# EAGLE design peaks_v30 (EAGLE 5.09)

## Sheet 1 of 3
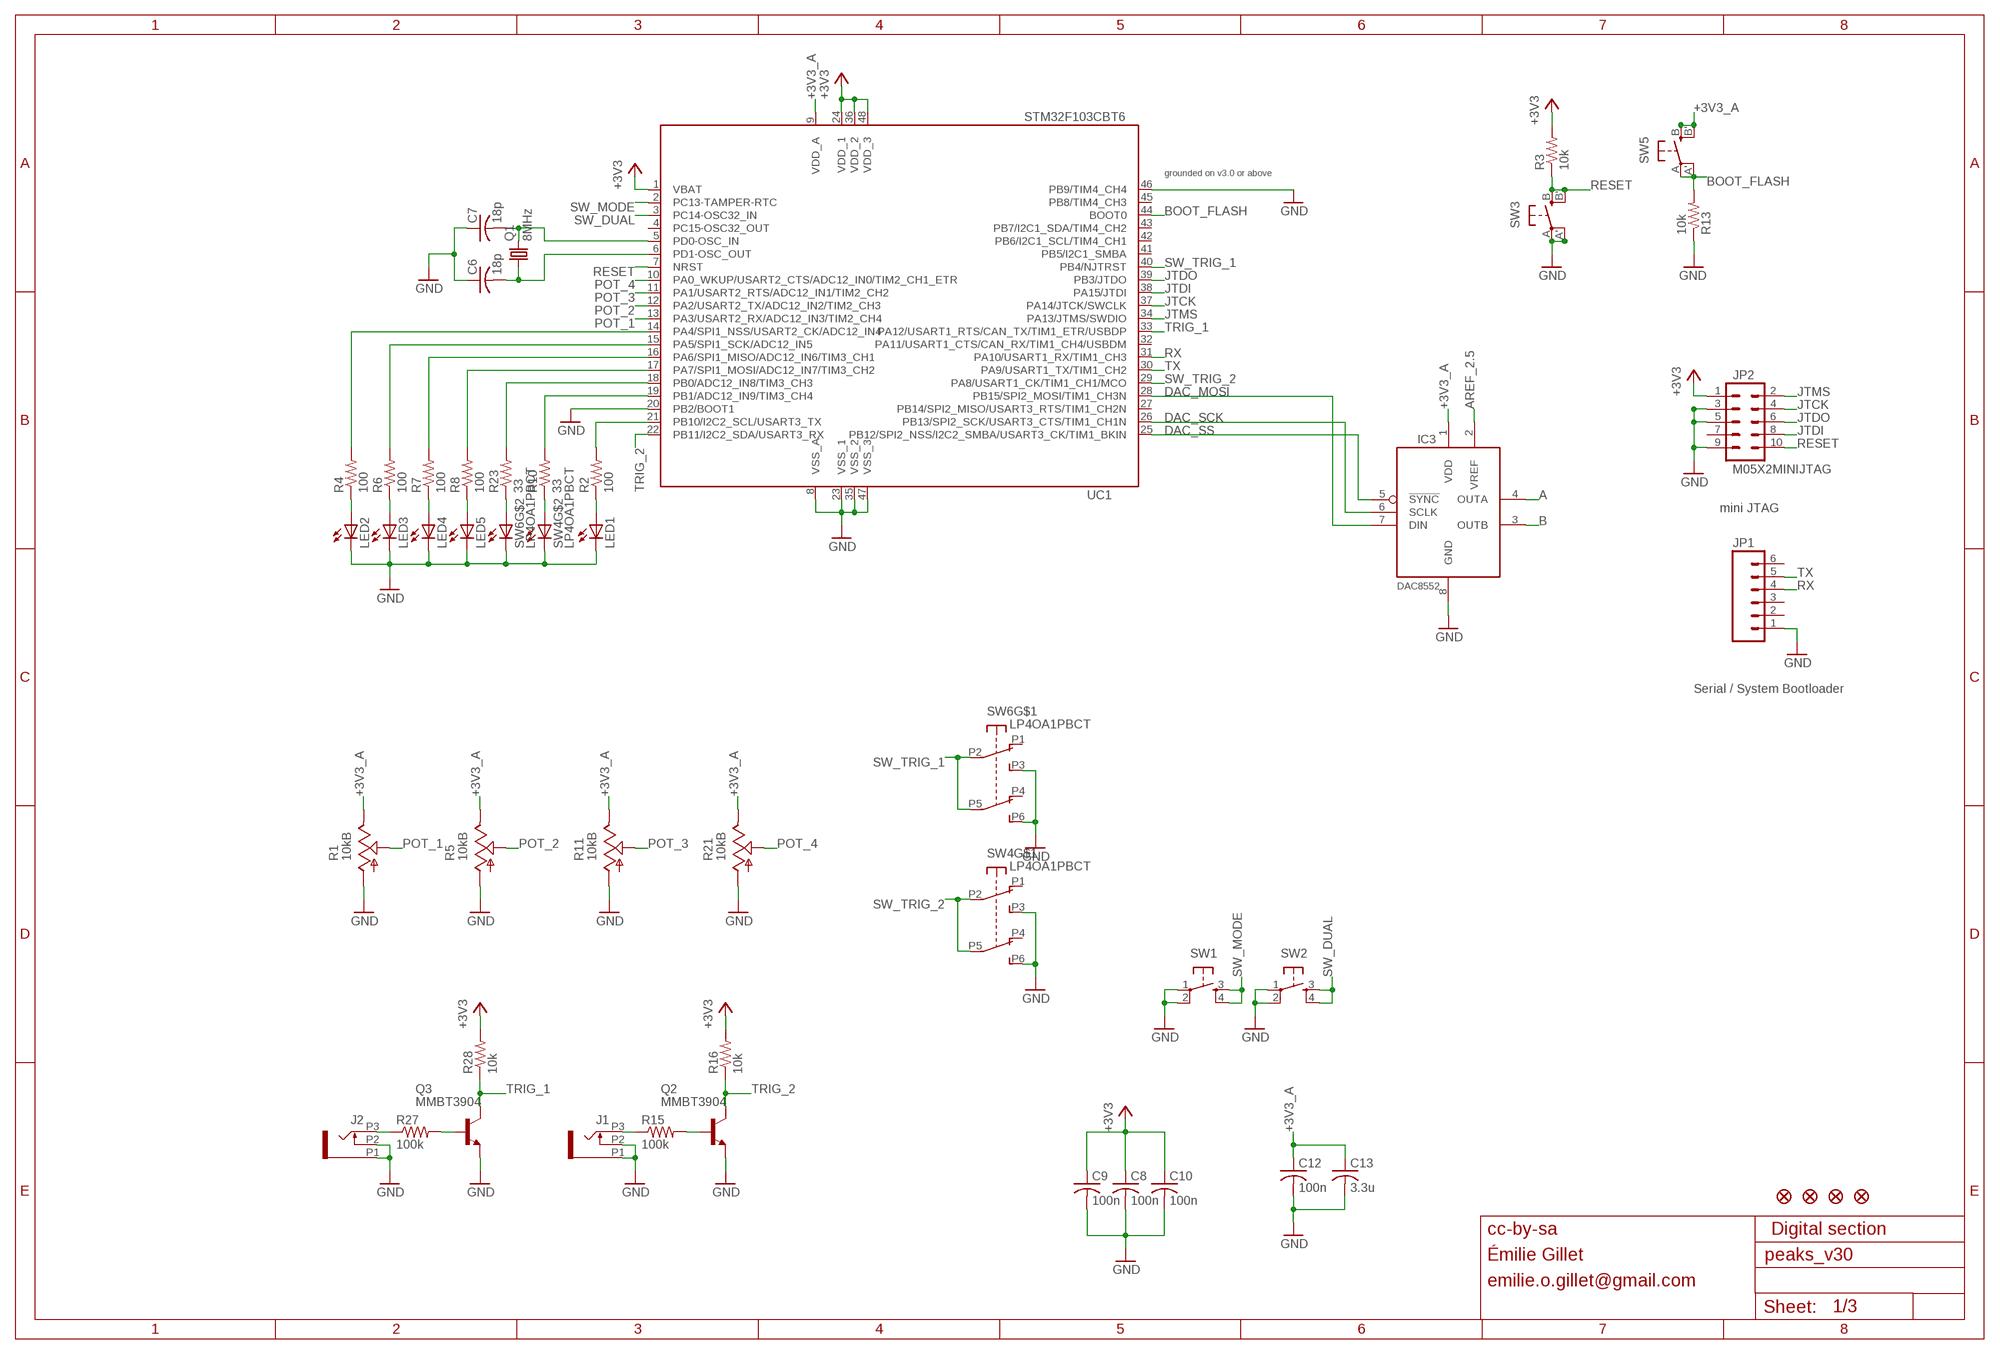
[diagram p0: schematic, sheet 1]

### Parts
C6  18p  C-USC0603  [C0603]
C7  18p  C-USC0603  [C0603]
C8  100n  C-USC0603  [C0603]
C9  100n  C-USC0603  [C0603]
C10  100n  C-USC0603  [C0603]
C12  100n  C-USC0603  [C0603]
C13  3.3u  C-USC0603  [C0603]
F1  FIDUCIAL1X2  [FIDUCIAL-1X2]
F2  FIDUCIAL1X2  [FIDUCIAL-1X2]
F3  FIDUCIAL1X2  [FIDUCIAL-1X2]
F4  FIDUCIAL1X2  [FIDUCIAL-1X2]
IC3  DAC8552  [MSOP-8]
J1  PJ301_THONKICONN6  [WQP_PJ_301M6]
J2  PJ301_THONKICONN6  [WQP_PJ_301M6]
JP1  M06SIP  [1X06]
JP2  M05X2MINIJTAG  [2X5-1.27]
LED1  LED3MM  [LED3MM]
LED2  LED3MM  [LED3MM]
LED3  LED3MM  [LED3MM]
LED4  LED3MM  [LED3MM]
LED5  LED3MM  [LED3MM]
Q1  8MHz  CRYSTALHC49UP  [HC49UP]
Q2  MMBT3904  MMBT3904LT1-NPN-SOT23-BEC  [SOT23-BEC]
Q3  MMBT3904  MMBT3904LT1-NPN-SOT23-BEC  [SOT23-BEC]
R1  10kB  POT_USVERTICAL_PS  [ALPS_POT_VERTICAL_PS]
R2  100  R-US_R0603  [R0603]
R3  10k  R-US_R0603  [R0603]
R4  100  R-US_R0603  [R0603]
R5  10kB  POT_USVERTICAL_PS  [ALPS_POT_VERTICAL_PS]
R6  100  R-US_R0603  [R0603]
R7  100  R-US_R0603  [R0603]
R8  100  R-US_R0603  [R0603]
R10  33  R-US_R0603  [R0603]
R11  10kB  POT_USVERTICAL_PS  [ALPS_POT_VERTICAL_PS]
R13  10k  R-US_R0603  [R0603]
R15  100k  R-US_R0603  [R0603]
R16  10k  R-US_R0603  [R0603]
R21  10kB  POT_USVERTICAL_PS  [ALPS_POT_VERTICAL_PS]
R23  33  R-US_R0603  [R0603]
R27  100k  R-US_R0603  [R0603]
R28  10k  R-US_R0603  [R0603]
SW1  TAC_SWITCHPTH  [TACTILE-PTH]
SW2  TAC_SWITCHPTH  [TACTILE-PTH]
SW3  EVQQ2  [EVQ-Q2]
SW4  LP4OA1PBCT  [LP4OA1PBCT]
SW5  EVQQ2  [EVQ-Q2]
SW6  LP4OA1PBCT  [LP4OA1PBCT]
UC1  STM32F103CBT6  STM32F103CB  [LQFP48]

### Nets
+3V3: C8.1 C9.1 C10.1 JP2.1 R3.2 R16.2 R28.2 UC1.1(VBAT) UC1.24(VDD_1) UC1.36(VDD_2) UC1.48(VDD_3) ; also sheet 3
+3V3_A: C12.1 C13.1 IC3.1(VDD) R1.P$1(E) R5.P$1(E) R11.P$1(E) R21.P$1(E) SW5.B'(S1) SW5.B(S) UC1.9(VDD_A) ; also sheet 3
A: IC3.4(OUTA) ; also sheet 2
AREF_2.5: IC3.2(VREF) ; also sheet 3
B: IC3.3(OUTB) ; also sheet 2
BOOT_FLASH: R13.2 SW5.A'(P1) SW5.A(P) UC1.44(BOOT0)
DAC_MOSI: IC3.7(DIN) UC1.28(PB15/SPI2_MOSI/TIM1_CH3N)
DAC_SCK: IC3.6(SCLK) UC1.26(PB13/SPI2_SCK/USART3_CTS/TIM1_CH1N)
DAC_SS: IC3.5(!SYNC) UC1.25(PB12/SPI2_NSS/I2C2_SMBA/USART3_CK/TIM1_BKIN)
GND: C6.1 C7.1 C8.2 C9.2 C10.2 C12.2 C13.2 IC3.8(GND) J1.P1 J1.P2 J2.P1 J2.P2 JP1.1 JP2.3 JP2.5 JP2.9 LED1.K(C) LED2.K(C) LED3.K(C) LED4.K(C) LED5.K(C) Q2.E Q3.E R1.P$3(A) R5.P$3(A) R11.P$3(A) R13.1 R21.P$3(A) SW1.1 SW1.2 SW2.1 SW2.2 SW3.A'(P1) SW3.A(P) SW4.L2 SW4.P3(A3) SW4.P6(B3) SW6.L2 SW6.P3(A3) SW6.P6(B3) UC1.8(VSS_A) UC1.20(PB2/BOOT1) UC1.23(VSS_1) UC1.35(VSS_2) UC1.46(PB9/TIM4_CH4) UC1.47(VSS_3) ; also sheet 2,3
JTCK: JP2.4 UC1.37(PA14/JTCK/SWCLK)
JTDI: JP2.8 UC1.38(PA15/JTDI)
JTDO: JP2.6 UC1.39(PB3/JTDO)
JTMS: JP2.2 UC1.34(PA13/JTMS/SWDIO)
N$1: J1.P3 R15.1
N$2: R23.2 UC1.18(PB0/ADC12_IN8/TIM3_CH3)
N$3: LED2.A R4.1
N$4: LED3.A R6.1
N$5: LED4.A R7.1
N$6: LED5.A R8.1
N$7: C7.2 Q1.2 UC1.5(PD0-OSC_IN)
N$8: C6.2 Q1.1 UC1.6(PD1-OSC_OUT)
N$9: R10.2 UC1.19(PB1/ADC12_IN9/TIM3_CH4)
N$10: R4.2 UC1.14(PA4/SPI1_NSS/USART2_CK/ADC12_IN4)
N$11: R6.2 UC1.15(PA5/SPI1_SCK/ADC12_IN5)
N$12: R7.2 UC1.16(PA6/SPI1_MISO/ADC12_IN6/TIM3_CH1)
N$13: R8.2 UC1.17(PA7/SPI1_MOSI/ADC12_IN7/TIM3_CH2)
N$14: Q2.B R15.2
N$16: R23.1 SW6.L1
N$17: R10.1 SW4.L1
N$18: LED1.A R2.1
N$19: R2.2 UC1.21(PB10/I2C2_SCL/USART3_TX)
N$57: J2.P3 R27.1
N$66: Q3.B R27.2
POT_1: R1.P$2(S) UC1.13(PA3/USART2_RX/ADC12_IN3/TIM2_CH4)
POT_2: R5.P$2(S) UC1.12(PA2/USART2_TX/ADC12_IN2/TIM2_CH3)
POT_3: R11.P$2(S) UC1.11(PA1/USART2_RTS/ADC12_IN1/TIM2_CH2)
POT_4: R21.P$2(S) UC1.10(PA0_WKUP/USART2_CTS/ADC12_IN0/TIM2_CH1_ETR)
RESET: JP2.10 R3.1 SW3.B'(S1) SW3.B(S) UC1.7(NRST)
RX: JP1.4 UC1.31(PA10/USART1_RX/TIM1_CH3)
SW_DUAL: SW2.3 SW2.4 UC1.3(PC14-OSC32_IN)
SW_MODE: SW1.3 SW1.4 UC1.2(PC13-TAMPER-RTC)
SW_TRIG_1: SW6.P2(A2) SW6.P5(B2) UC1.40(PB4/NJTRST)
SW_TRIG_2: SW4.P2(A2) SW4.P5(B2) UC1.29(PA8/USART1_CK/TIM1_CH1/MCO)
TRIG_1: Q3.C R28.1 UC1.33(PA12/USART1_RTS/CAN_TX/TIM1_ETR/USBDP)
TRIG_2: Q2.C R16.1 UC1.22(PB11/I2C2_SDA/USART3_RX)
TX: JP1.5 UC1.30(PA9/USART1_TX/TIM1_CH2)
Unconnected: JP1.2 JP1.3 JP1.6 JP2.7 SW4.P1(A1) SW4.P4(B1) SW6.P1(A1) SW6.P4(B1) UC1.4(PC15-OSC32_OUT) UC1.27(PB14/SPI2_MISO/USART3_RTS/TIM1_CH2N) UC1.32(PA11/USART1_CTS/CAN_RX/TIM1_CH4/USBDM) UC1.41(PB5/I2C1_SMBA) UC1.42(PB6/I2C1_SCL/TIM4_CH1) UC1.43(PB7/I2C1_SDA/TIM4_CH2) UC1.45(PB8/TIM4_CH3)

### Notes on the sheet
- grounded on v3.0 or above
- mini JTAG
- Serial / System Bootloader
- cc-by-sa | Digital section
- Émilie Gillet
- emilie.o.gillet@gmail.com

## Sheet 2 of 3
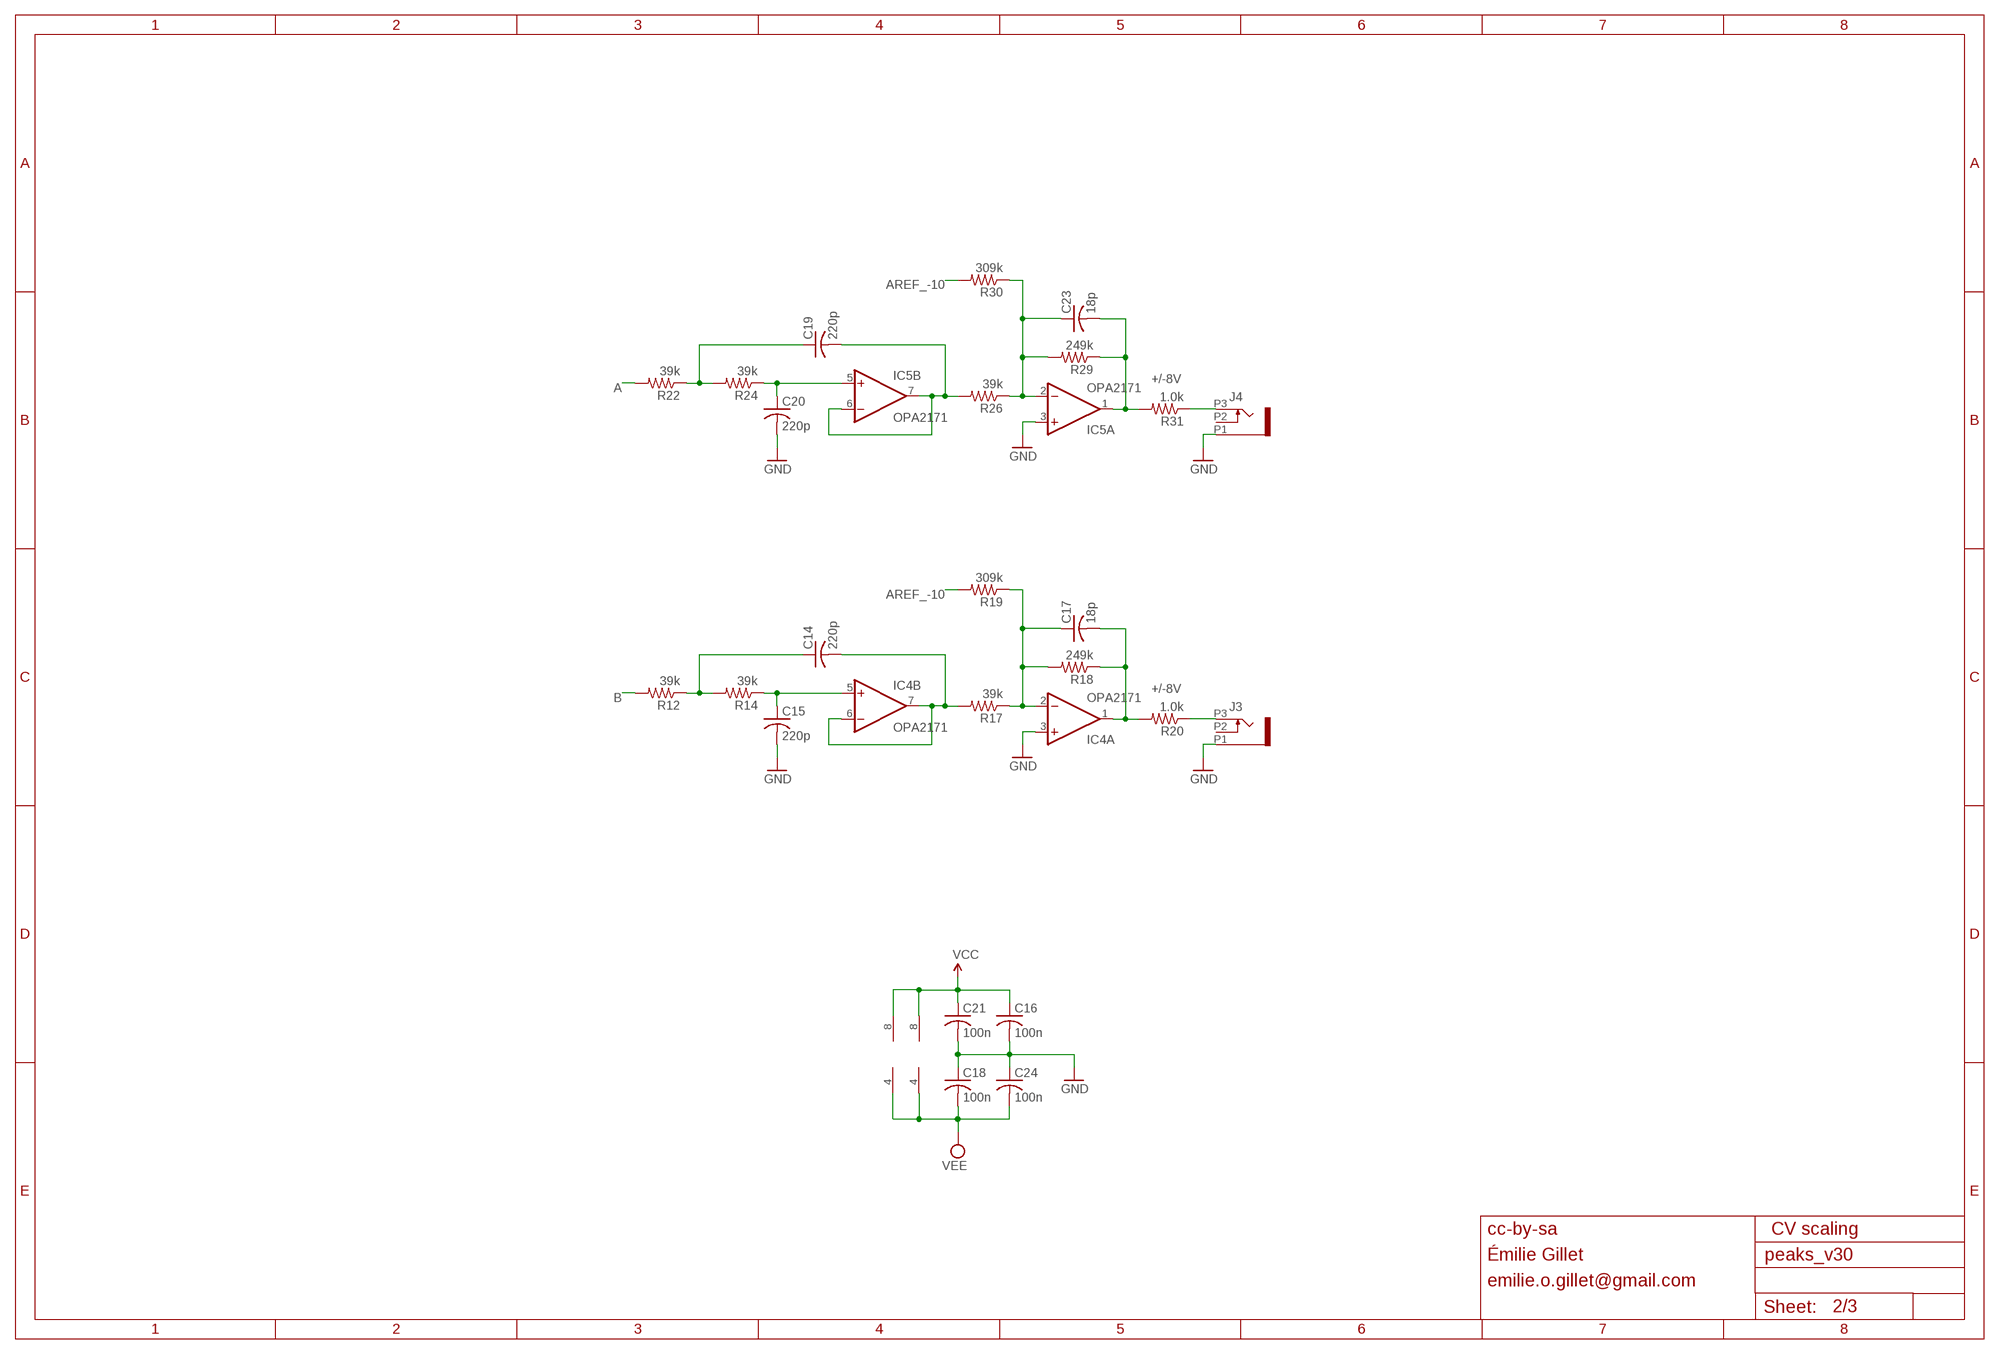
[diagram p1: schematic, sheet 2]

### Parts
C14  220p  C-USC0603  [C0603]
C15  220p  C-USC0603  [C0603]
C16  100n  C-USC0603  [C0603]
C17  18p  C-USC0603  [C0603]
C18  100n  C-USC0603  [C0603]
C19  220p  C-USC0603  [C0603]
C20  220p  C-USC0603  [C0603]
C21  100n  C-USC0603  [C0603]
C23  18p  C-USC0603  [C0603]
C24  100n  C-USC0603  [C0603]
IC4  OPA2171  TL072D  [SO08]
IC5  OPA2171  TL072D  [SO08]
J3  PJ301_THONKICONN6  [WQP_PJ_301M6]
J4  PJ301_THONKICONN6  [WQP_PJ_301M6]
R12  39k  R-US_R0603  [R0603]
R14  39k  R-US_R0603  [R0603]
R17  39k  R-US_R0603  [R0603]
R18  249k  R-US_R0603  [R0603]
R19  309k  R-US_R0603  [R0603]
R20  1.0k  R-US_R0603  [R0603]
R22  39k  R-US_R0603  [R0603]
R24  39k  R-US_R0603  [R0603]
R26  39k  R-US_R0603  [R0603]
R29  249k  R-US_R0603  [R0603]
R30  309k  R-US_R0603  [R0603]
R31  1.0k  R-US_R0603  [R0603]

### Nets
A: R22.2 ; also sheet 1
AREF_-10: R19.2 R30.2 ; also sheet 3
B: R12.2 ; also sheet 1
BI_OUT: C17.2 IC4.1(A:OUT) R18.1 R20.2
BI_OUT1: C23.2 IC5.1(A:OUT) R29.1 R31.2
F_CV: C17.1 IC4.2(A:-IN) R17.1 R18.2 R19.1
F_CV1: C23.1 IC5.2(A:-IN) R26.1 R29.2 R30.1
GND: C15.2 C16.2 C18.1 C20.2 C21.2 C24.1 IC4.3(A:+IN) IC5.3(A:+IN) J3.P1 J4.P1 ; also sheet 1,3
N$15: C19.2 IC5.6(B:-IN) IC5.7(B:OUT) R26.2
N$20: C20.1 IC5.5(B:+IN) R24.1
N$21: C19.1 R22.1 R24.2
N$22: J3.P3 R20.1
N$24: J4.P3 R31.1
N$42: C14.2 IC4.6(B:-IN) IC4.7(B:OUT) R17.2
N$43: C15.1 IC4.5(B:+IN) R14.1
N$45: C14.1 R12.1 R14.2
VCC: C16.1 C21.1 IC4.8(P:V+) IC5.8(P:V+) ; also sheet 3
VEE: C18.2 C24.2 IC4.4(P:V-) IC5.4(P:V-) ; also sheet 3
Unconnected: J3.P2 J4.P2

### Notes on the sheet
- +/-8V
- +/-8V
- cc-by-sa | CV scaling
- Émilie Gillet
- emilie.o.gillet@gmail.com

## Sheet 3 of 3
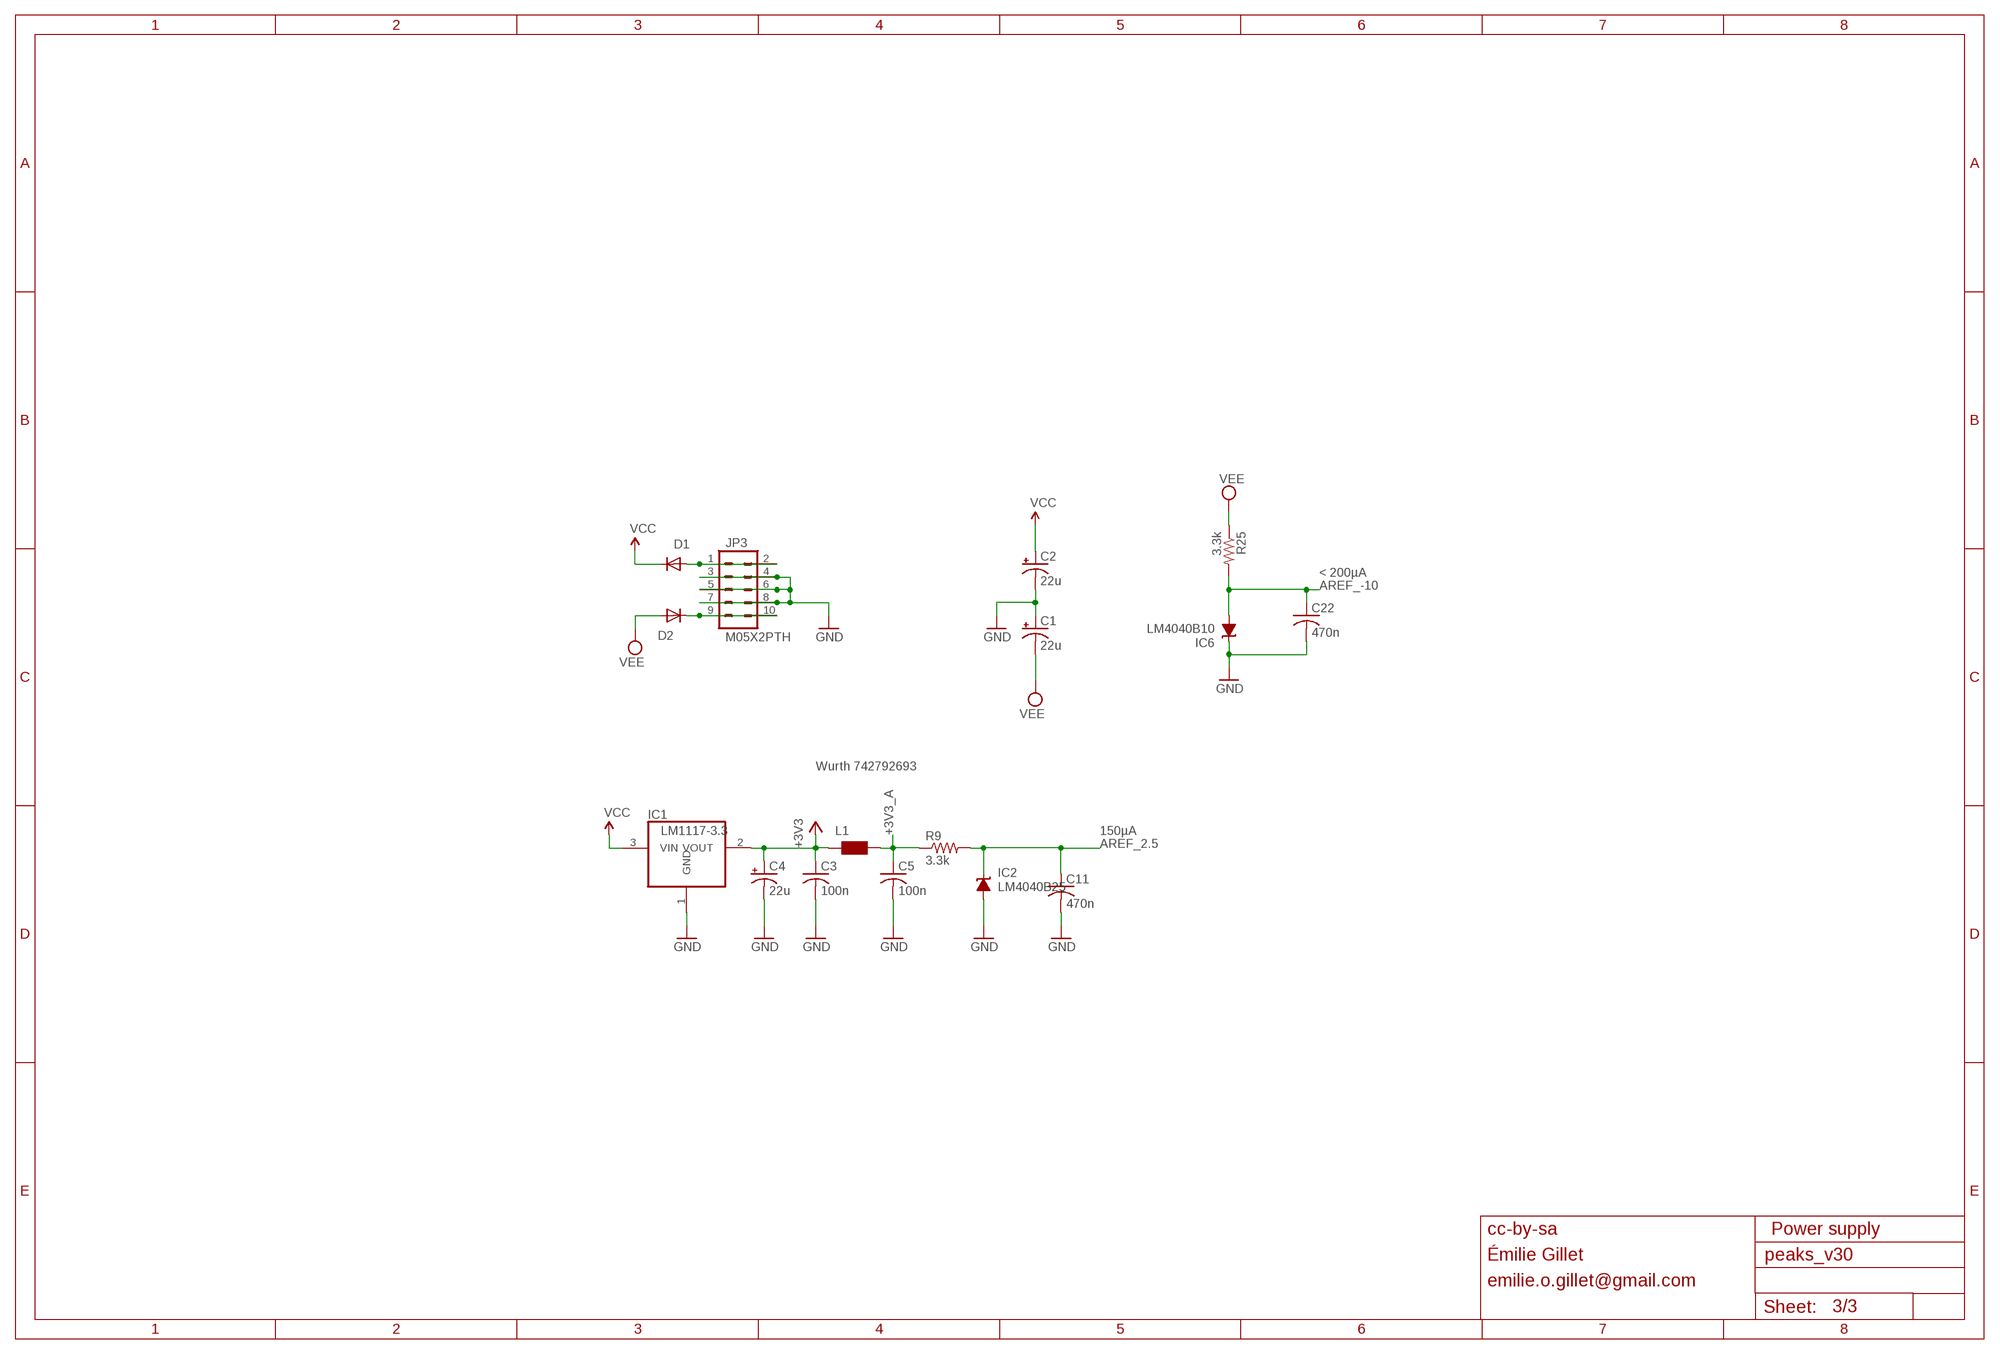
[diagram p2: schematic, sheet 3]

### Parts
C1  22u  CPOL-USC  [PANASONIC_C]
C2  22u  CPOL-USC  [PANASONIC_C]
C3  100n  C-USC0603  [C0603]
C4  22u  CPOL-USC  [PANASONIC_C]
C5  100n  C-USC0603  [C0603]
C11  470n  C-USC0603  [C0603]
C22  470n  C-USC0603  [C0603]
D1  1N5819HW  DIODE-SOD123  [SOD123]
D2  1N5819HW  DIODE-SOD123  [SOD123]
IC1  LM1117-3.3  REG1117  [SOT223]
IC2  LM4040B25  LM4041B12DBZ  [DBZ_R-PDSO-G3]
IC6  LM4040B10  LM4041B12DBZ  [DBZ_R-PDSO-G3]
JP3  M05X2PTH  [AVR_ICSP]
L1  WE-CBF_0603  [0603]
R9  3.3k  R-US_R0603  [R0603]
R25  3.3k  R-US_R0603  [R0603]

### Nets
+3V3: C3.1 C4.+ IC1.2(VOUT) L1.1 ; also sheet 1
+3V3_A: C5.1 L1.2 R9.1 ; also sheet 1
AREF_2.5: C11.1 IC2.1(C) R9.2 ; also sheet 1
AREF_-10: C22.1 IC6.2(A) R25.2 ; also sheet 2
GND: C1.+ C2.- C3.2 C4.- C5.2 C11.2 C22.2 IC1.1(GND) IC2.2(A) IC6.1(C) JP3.3 JP3.4 JP3.5 JP3.6 JP3.7 JP3.8 ; also sheet 1,2
N$56: D1.A JP3.1 JP3.2
N$64: D2.C JP3.9 JP3.10
VCC: C2.+ D1.C IC1.3(VIN) ; also sheet 2
VEE: C1.- D2.A R25.1 ; also sheet 2

### Notes on the sheet
- < 200µA
- Wurth 742792693
- 150µA
- cc-by-sa | Power supply
- Émilie Gillet
- emilie.o.gillet@gmail.com

## Library data of the parts
C1 C2 C4 = rcl:CPOL-US: POLARIZED CAPACITOR, American symbol
C3 C5-C24 = rcl:C-US: CAPACITOR, American symbol
D1 D2 = diode:DIODE-: DIODE
F1-F4 = SparkFun:FIDUCIAL: Fiducial Alignment Points Various fiducial points for machine vision alignment.
IC1 = og-vreg:REG1117: 800mA and 1A Low Dropout (LDO) Positive Regulator 1.8V, 2.5V, 2.85V, 3.3V, 5V, and Adj
IC2 IC6 = texas:LM4041: PRECISION MICROPOWER SHUNT VOLTAGE REFERENCE Source: http://focus.ti.com/lit/ds/slcs146e/slcs146e.pdf
IC3 = og-dac:DAC8552
IC4 IC5 = linear:TL072: OP AMP
J1-J4 = og-pj301:PJ301_THONKICONN
JP1 = SparkFun:M06: Header 6 Standard 6-pin 0.1" header. Use with straight break away headers (SKU : PRT-00116), right angle break away headers (PRT-00553), swiss pins (PRT-00743), machine pins (PRT-00117), and female headers (PRT-00115). Molex polarized connector foot print use with SKU : PRT-08094 with associated crimp pins and housings. NOTES ON THE VARIANTS LOCK and LOCK_LONGPADS... This footprint was designed to help hold the alignment of a through-hole component (i.e. 6-pin header) while soldering it into place. You may notice that each hole has been shifted either up or down by 0.005 of an inch from it's more standard position (which is a perfectly straight line). This slight alteration caused the pins (the squares in the middle) to touch the edges of the holes. Because they are alternating, it causes a "brace" to hold the component in place. 0.005 has proven to be the perfect amount of "off-center" position when using our standard breakaway headers. Although looks a little odd when you look at the bare footprint, once you have a header in there, the alteration is very hard to notice. Also, if you push a header all the way into place, it is covered up entirely on the bottom side. This idea of altering the position of holes to aid alignment will be further integrated into the Sparkfun Library for other footprints. It can help hold any component with 3 or more connection pins.
JP2 JP3 = og-header:M05X2: Header 5x2 Standard 10-pin dual row 0.1" header. Commonly used with AVR-ISP. Use with Spark Fun Electronics SKU: PRT-00778
L1 = wuerth-elektronik:WE-CBF: SMD EMI Suppression Ferrite Beads - excellent anti-EMI properties - low DCR - impedances till 3000 ohms - rated current up to 6 A
LED1-LED5 = led:LED: LED OSRAM: - CHIPLED LG R971, LG N971, LY N971, LG Q971, LY Q971, LO R971, LY R971 LH N974, LH R974 LS Q976, LO Q976, LY Q976 LO Q996 - Hyper CHIPLED LW Q18S LB Q993, LB Q99A, LB R99A - SideLED LS A670, LO A670, LY A670, LG A670, LP A670 LB A673, LV A673, LT A673, LW A673 LH A674 LY A675 LS A676, LA A676, LO A676, LY A676, LW A676 LS A679, LY A679, LG A679 - Hyper Micro SIDELED® LS Y876, LA Y876, LO Y876, LY Y876 LT Y87S - SmartLED LW L88C, LW L88S LB L89C, LB L89S, LG L890 LS L89K, LO L89K, LY L89K LS L896, LA L896, LO L896, LY L896 - TOPLED LS T670, LO T670, LY T670, LG T670, LP T670 LSG T670, LSP T670, LSY T670, LOP T670, LYG T670 LG T671, LOG T671, LSG T671 LB T673, LV T673, LT T673, LW T673 LH T674 LS T676, LA T676, LO T676, LY T676, LB T676, LH T676, LSB T676, LW T676 LB T67C, LV T67C, LT T67C, LS T67K, LO T67K, LY T67K, LW E67C LS E67B, LA E67B, LO E67B, LY E67B, LB E67C, LV E67C, LT E67C LW T67C LS T679, LY T679, LG T679 LS T770, LO T770, LY T770, LG T770, LP T770 LB T773, LV T773, LT T773, LW T773 LH T774 LS E675, LA E675, LY E675, LS T675 LS T776, LA T776, LO T776, LY T776, LB T776 LHGB T686 LT T68C, LB T68C - Hyper Mini TOPLED® LB M676 - Mini TOPLED Santana® LG M470 LS M47K, LO M47K, LY M47K Source: http://www.osram.convergy.de LUXEON: - LUMILED® LXK2-PW12-R00, LXK2-PW12-S00, LXK2-PW14-U00, LXK2-PW14-V00 LXK2-PM12-R00, LXK2-PM12-S00, LXK2-PM14-U00 LXK2-PE12-Q00, LXK2-PE12-R00, LXK2-PE12-S00, LXK2-PE14-T00, LXK2-PE14-U00 LXK2-PB12-K00, LXK2-PB12-L00, LXK2-PB12-M00, LXK2-PB14-N00, LXK2-PB14-P00, LXK2-PB14-Q00 LXK2-PR12-L00, LXK2-PR12-M00, LXK2-PR14-Q00, LXK2-PR14-R00 LXK2-PD12-Q00, LXK2-PD12-R00, LXK2-PD12-S00 LXK2-PH12-R00, LXK2-PH12-S00 LXK2-PL12-P00, LXK2-PL12-Q00, LXK2-PL12-R00 Source: www.luxeon.com KINGBRIGHT: KA-3528ASYC Source: www.kingbright.com
Q1 = crystal:CRYSTAL: CRYSTAL
Q2 Q3 = transistor:*-NPN-: NPN Transistror BF959 corrected 2008.03.06
R1 R5 R11 R21 = pot-alps:POT_US
R2-R4 R6-R10 R12-R20 R22-R31 = rcl:R-US_: RESISTOR, American symbol
SW1 SW2 = SparkFun:TAC_SWITCH: Momentary Switch Button commonly used for reset or general input. Spark Fun Electronics SKU : COM-00097
SW3 SW5 = adafruit:EVQQ2: SMT 6mm switch, EVQQ2 series http://www.ladyada.net/library/eagle
SW4 SW6 = og-switch:LP4OA1PBCT
UC1 = stm32:STM32F103CB

## Board
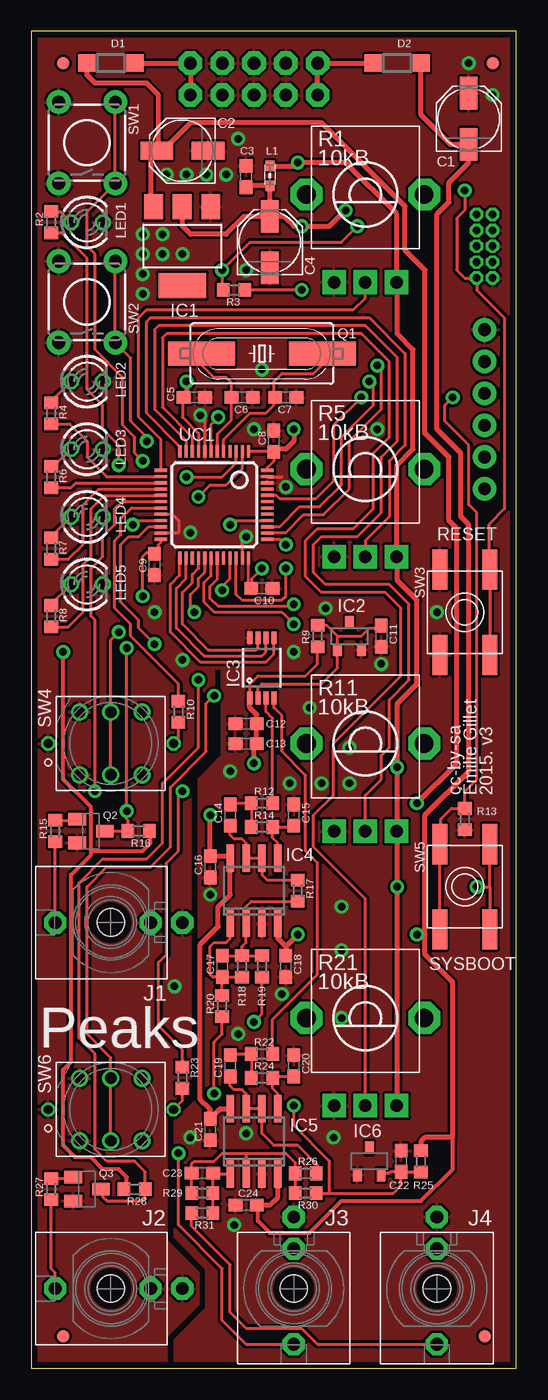
[diagram p3: board, top side]
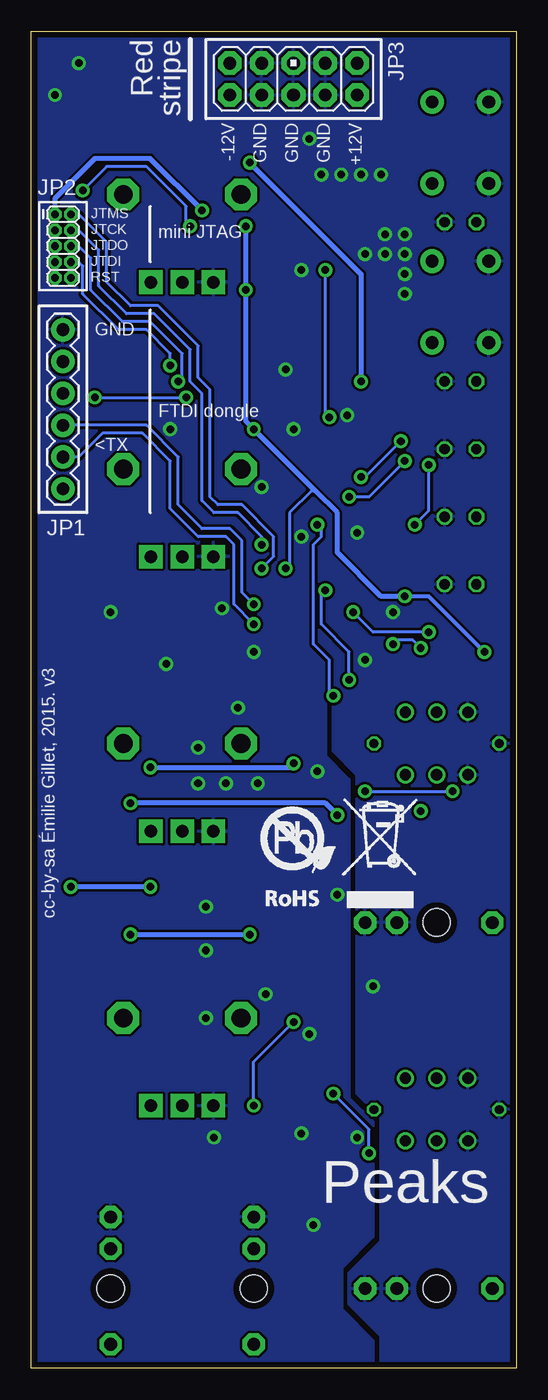
[diagram p4: board, bottom side, seen from below]

Size 38.72 x 106.68 mm. Coordinates in mm from the lower left corner, seen from the top.
Outline: 0,0 38.72,0 38.72,106.68 0,106.68 0,0
Copper layers (1*16): Top 0.035mm / dielectric 1.5mm / Bottom 0.035mm
Design rules "PCBCart-Standard": minimum track width 8mil, minimum drill 0.4mm, track to track 8mil, track to pad 8mil, pad to pad 8mil, via to via 8mil, smd to smd 8mil, copper to edge 20mil, drill to drill 8mil, minimum pad ring 8mil, minimum via ring 10mil, stop-mask expansion 3mil, vias tented up to drill 25mil, thermal gap 8mil

### Footprints (pad centres in the part's own frame; a part is rotated, then mirrored left to right if it is on the bottom)
PANASONIC_C = smd 2.6 x 1.4: + 2.05,0; - -2.05,0
C0603 = smd 1.1 x 1: 1 -0.85,0; 2 0.85,0
SOD123 = smd 1.4 x 1.4: A 1.9,0; C -1.9,0
FIDUCIAL-1X2 = smd 1 x 1: 1 0,0
SOT223 = smd 1.499 x 2.007: 1 -2.261,-3.15; 2 0.025,-3.15; 3 2.311,-3.15 | smd 3.81 x 2.007: 4 0,3.15
DBZ_R-PDSO-G3 = smd 0.7 x 1: 1 -0.95,-1.1; 2 0.95,-1.1; 3 0,1.1
MSOP-8 = smd 0.41 x 1.02: 1 -0.975,-2.4; 2 -0.325,-2.4; 3 0.325,-2.4; 4 0.975,-2.4; 5 0.975,2.4; 6 0.325,2.4; 7 -0.325,2.4; 8 -0.975,2.4
SO08 = smd 0.6 x 2.2: 1 -1.905,-2.6; 2 -0.635,-2.6; 3 0.635,-2.6; 4 1.905,-2.6; 5 1.905,2.6; 6 0.635,2.6; 7 -0.635,2.6; 8 -1.905,2.6
WQP_PJ_301M6 = drill 1.016 pad 1.778 octagon: P1 0,-5.715; P2 0,-3.175; P3 0,4.445 | hole 2.2: 0,0
1X06 = drill 1.016 pad 1.88 round: 1 0,0; 2 2.54,0; 3 5.08,0; 4 7.62,0; 5 10.16,0; 6 12.7,0
2X5-1.27 = drill 0.61 pad 1.067 octagon: 1 -1.27,3.81; 2 0,3.81; 3 -1.27,2.54; 4 0,2.54; 5 -1.27,1.27; 6 0,1.27; 7 -1.27,0; 8 0,0; 9 -1.27,-1.27; 10 0,-1.27
AVR_ICSP = drill 1.016 pad 1.88 octagon: 1 -1.27,5.08; 2 1.27,5.08; 3 -1.27,2.54; 4 1.27,2.54; 5 -1.27,0; 6 1.27,0; 7 -1.27,-2.54; 8 1.27,-2.54; 9 -1.27,-5.08; 10 1.27,-5.08
0603 = smd 0.85 x 0.7: 1 -0.9,0; 2 0.7,0
LED3MM = drill 0.813 octagon: A -1.27,0; K 1.27,0
HC49UP = smd 5.334 x 1.93: 1 -4.826,0; 2 4.826,0
SOT23-BEC = smd 1 x 1.4: B -0.95,-1.1; C 0,1.1; E 0.95,-1.1
ALPS_POT_VERTICAL_PS = drill 1 pad 1.88 square: P$1 -2.5,7; P$2 0,7; P$3 2.5,7 | drill 1.5 pad 2.54 octagon: P$4 -4.7,0; P$5 4.7,0
R0603 = smd 1 x 1.1: 1 -0.85,0; 2 0.85,0
TACTILE-PTH = drill 1.016 pad 1.88 round: 1 -3.251,2.261; 2 3.251,2.261; 3 -3.251,-2.261; 4 3.251,-2.261
EVQ-Q2 = smd 3.2 x 1.2: A -3.4,-2; A' 3.4,-2; B -3.4,2; B' 3.4,2
LP4OA1PBCT = drill 0.7 octagon: L1 5,0; L2 -5,0 | drill 0.9 round: P1 2.5,2.5; P2 0,2.5; P3 -2.5,2.5; P4 2.5,-2.5; P5 0,-2.5; P6 -2.5,-2.5
LQFP48 = smd 0.254 x 1: 1 -2.75,-4.25; 2 -2.25,-4.25; 3 -1.75,-4.25; 4 -1.25,-4.25; 5 -0.75,-4.25; 6 -0.25,-4.25; 7 0.25,-4.25; 8 0.75,-4.25; 9 1.25,-4.25; 10 1.75,-4.25; 11 2.25,-4.25; 12 2.75,-4.25; 25 2.75,4.25; 26 2.25,4.25; 27 1.75,4.25; 28 1.25,4.25; 29 0.75,4.25; 30 0.25,4.25; 31 -0.25,4.25; 32 -0.75,4.25; 33 -1.25,4.25; 34 -1.75,4.25; 35 -2.25,4.25; 36 -2.75,4.25 | smd 1 x 0.254: 13 4.25,-2.75; 14 4.25,-2.25; 15 4.25,-1.75; 16 4.25,-1.25; 17 4.25,-0.75; 18 4.25,-0.25; 19 4.25,0.25; 20 4.25,0.75; 21 4.25,1.25; 22 4.25,1.75; 23 4.25,2.25; 24 4.25,2.75; 37 -4.25,2.75; 38 -4.25,2.25; 39 -4.25,1.75; 40 -4.25,1.25; 41 -4.25,0.75; 42 -4.25,0.25; 43 -4.25,-0.25; 44 -4.25,-0.75; 45 -4.25,-1.25; 46 -4.25,-1.75; 47 -4.25,-2.25; 48 -4.25,-2.75

### Placement (x,y rotation side)
C1  34.92,99.69 90 top
C2  12.06,97.16 180 top
C3  17.14,95.09 90 top
C4  19.05,89.85 90 top
C5  13.02,77.47 0 top
C6  16.83,77.47 180 top
C7  20.32,77.47 180 top
C8  19.37,73.98 90 top
C9  9.84,64.14 270 top
C10  18.41,62.23 0 top
C11  27.94,58.42 270 top
C12  17.14,51.44 180 top
C13  17.14,49.85 180 top
C14  15.88,44.13 270 top
C15  20.95,44.13 90 top
C16  14.29,40.01 270 top
C17  15.24,32.07 270 top
C18  20.32,32.07 90 top
C19  15.88,24.13 270 top
C20  20.95,24.13 90 top
C21  14.29,19.05 270 top
C22  29.53,16.51 90 top
C23  13.65,15.56 0 top
C24  17.14,13.02 0 top
D1  6.35,104.14 0 top
D2  29.21,104.14 0 top
F1  2.54,104.14 0 top
F2  36.83,104.14 0 top
F3  2.54,2.54 0 top
F4  36.2,2.54 0 top
IC1  12.06,89.53 180 top
IC2  25.4,58.42 0 top
IC3  18.41,55.88 0 top
IC4  17.78,38.1 0 top
IC5  17.78,18.1 0 top
IC6  26.99,16.51 0 top
J1  6.35,35.56 90 top
J2  6.35,6.35 90 top
J3  20.95,6.35 180 top
J4  32.38,6.35 180 top
JP1  36.2,82.87 270 bottom
JP2  35.56,88.27 0 bottom
JP3  17.78,102.87 270 bottom
L1  19.05,95.25 90 top
LED1  4.45,91.44 0 top
LED2  4.45,78.74 0 top
LED3  4.45,73.34 0 top
LED4  4.45,67.94 0 top
LED5  4.45,62.55 0 top
Q1  18.41,80.96 0 top
Q2  4.76,42.86 270 top
Q3  4.45,14.29 270 top
R1  26.67,93.66 180 top
R2  1.59,91.44 270 top
R3  16.19,86.04 0 top
R4  1.59,76.2 270 top
R5  26.67,71.75 180 top
R6  1.59,71.12 270 top
R7  1.59,65.41 270 top
R8  1.59,60.01 270 top
R9  22.86,58.42 90 top
R10  11.75,52.39 90 top
R11  26.67,49.85 180 top
R12  18.41,45.09 0 top
R13  34.61,43.81 90 top
R14  18.41,43.18 180 top
R15  1.91,42.86 90 top
R16  8.57,42.86 0 top
R17  21.27,38.1 90 top
R18  16.83,32.07 90 top
R19  18.41,32.07 270 top
R20  15.24,28.89 90 top
R21  26.67,27.94 180 top
R22  18.41,25.08 0 top
R23  12.06,23.18 90 top
R24  18.41,23.18 180 top
R25  31.11,16.51 270 top
R26  21.91,15.56 0 top
R27  1.59,14.29 90 top
R28  8.26,14.29 180 top
R29  13.65,13.97 180 top
R30  21.91,13.97 0 top
R31  13.65,12.38 0 top
SW1  4.45,97.79 90 top
SW2  4.45,85.09 90 top
SW3  34.61,60.33 270 top
SW4  6.35,49.85 0 top
SW5  34.61,38.42 270 top
SW6  6.35,20.64 0 top
U$2  [ROHS]  21.27,36.2 0 bottom
UC1  14.61,68.9 180 top

### Tracks (layer width: path | path; a pad name or v marks a point on that pad's centre or on a via)
+3V3  (via drill 0.6)
  Top 0.254: UC1.1 17.38,73.13 C8.1 19.37,72.39 18.86,71.88 UC1.48 | 9.95,65.09 C9.1 | 9.95,65.09 10.16,65.09 10.16,65.72 10.36,65.92 UC1.24 | 9.95,65.09 9.21,65.09 8.89,64.77 v8.89,61.59 | v21.59,86.04 R3.2 | UC1.36 17.36,62.44 C10.1 17.57,62.97 v18.41,63.82
  Top 0.305: R28.2 7.62,14.5 7.62,15.24 6.99,15.88 5.71,15.88 4.76,16.83 3.49,16.83 2.54,17.78 2.54,23.81 3.17,24.45 3.17,39.37 4.76,40.96 4.76,41.27 | v2.54,57.15 2.54,46.99 4.76,44.77 4.76,41.27 | R16.2 9.53,42.76 9.53,41.91 8.89,41.27 4.76,41.27
  Top 0.406: v25.08,92.39 23.81,91.12 v21.59,91.12 20.95,91.12 20.18,91.9 C4.+ | C8.1 19.58,73.34 20.32,73.34 20.95,73.98 v20.95,74.93 | C4.+ L1.1 17.25,94.35 C3.1 | IC1.2 12.06,92.66 12.06,91.12 12.7,90.49 15.56,90.49 16.97,91.9 C4.+
  Bottom 0.254: 16.03,70.01 16.35,70.01 18.1,68.26 18.1,64.14 v18.41,63.82
  Bottom 0.305: v2.54,57.15 6.99,61.59 v8.89,61.59
  Bottom 0.406: v25.08,92.39 29.21,96.52 33.66,96.52 36.83,93.34 JP2.1 | v8.89,61.59 10.79,61.59 14.29,65.09 14.29,68.26 16.03,70.01 v20.95,74.93 21.59,75.56 v21.59,86.04 v21.59,91.12
+3V3_A  (via drill 0.6)
  Top 0.254: C5.1 12.06,77.37 12.06,75.88 13.36,74.59 UC1.9 | 36.61,38.42 SW5.B' | 36.61,38.42 SW5.B | v35.56,38.42 36.61,38.42 | 17.46,53.46 17.46,54.61 18.1,55.24 21.91,55.24 22.86,56.2 R9.1
  Top 0.406: L1.2 19.11,95.89 20.95,95.89 v21.27,96.2 25.08,96.2 29.17,92.11 R1.P$1 29.21,86.62 29.21,82.55 30.48,81.28 30.48,73.34 29.17,72.03 R5.P$1 29.21,64.72 29.21,62.87 30.8,61.28 30.8,54.61 29.21,53.02 v29.21,47.94 29.21,43.81 29.17,43.77 R11.P$1 29.17,42.27 29.21,42.23 v29.21,38.42 29.21,20.98 R21.P$1 | 17.46,53.46 IC3.1 17.44,52.73 18,52.17 C12.1 C13.1 17.78,49.63 v17.78,48.26 | C5.1 12.38,77.69 v12.38,78.74
  Bottom 0.406: v17.78,48.26 18.1,47.94 v29.21,47.94 | v21.27,96.2 12.38,87.31 v12.38,78.74 | v29.21,38.42 v35.56,38.42
A
  Top 0.254: IC3.4 19.37,53.46 19.37,52.7 20,52.07 20,49.21 21.91,47.31 21.91,41.27 22.86,40.32 22.86,31.43 19.27,27.84 R22.2
AREF_2.5
  Top 0.254: IC3.2 18.1,54.29 18.41,54.61 23.18,54.61 24.45,55.88 IC2.1 24.45,58.42 | C11.1 27.73,59.05 26.99,59.05 26.35,58.42 24.45,58.42 | 24.45,58.42 23.6,59.27 R9.2
  Top 0.406: IC3.2
AREF_-10  (via drill 0.6)
  Top 0.254: C22.1 R25.2 | IC6.2 28.09,15.56 28.57,15.56 28.68,15.66 C22.1 | v17.78,27.62 18.41,28.26 R19.2 | R30.2 23.81,13.97 | 23.81,13.97 28.89,13.97 29.53,14.61 C22.1 | v20.95,20.95 20.95,19.37 23.81,16.51 23.81,13.97
  Bottom 0.254: v17.78,27.62 20.95,24.45 v20.95,20.95
B
  Top 0.254: IC3.3 18.73,52.39 19.27,51.85 R12.2
BI_OUT
  Top 0.254: IC4.1 15.88,34.29 15.56,33.97 14.61,33.97 14.29,33.66 14.29,31.43 14.5,31.22 C17.2 | C17.2 R18.1 | R20.2 C17.2
BI_OUT1
  Top 0.254: IC5.1 14.56,15.5 C23.2 R29.1 R31.2
BOOT_FLASH  (via drill 0.6)
  Top 0.254: SW5.A' SW5.A 32.7,41.91 32.7,43.81 33.55,44.66 R13.2 34.61,46.04 35.56,46.99 35.56,68.26 34.92,68.9 34.92,73.66 33.02,75.56 33.02,76.83 v33.66,77.47 | v26.35,77.47 24.13,75.25 24.13,70.8 22.7,69.37 19.84,69.37 19.57,69.65 UC1.44
  Bottom 0.254: v33.66,77.47 v26.35,77.47
DAC_MOSI
  Top 0.254: IC3.7 18.1,57.47 17.94,57.31 14.13,57.31 12.06,59.37 12.06,61.91 12.86,62.71 12.86,63.34 13.36,63.84 UC1.28
DAC_SCK
  Top 0.254: IC3.6 18.73,57.15 18.41,56.83 13.81,56.83 11.59,59.05 11.59,62.23 12.36,63 UC1.26
DAC_SS
  Top 0.254: IC3.5 19.37,58.26 19.37,56.99 18.73,56.36 13.49,56.36 11.11,58.74 11.11,62.55 11.86,63.29 UC1.25
F_CV
  Top 0.254: R18.2 16.83,33.66 17.14,33.97 IC4.2 17.14,36.83 17.57,37.25 R17.1 | R18.2 R19.1 | C17.1 R18.2
F_CV1
  Top 0.254: R30.1 R26.1 21.06,16.41 20.32,17.14 17.14,17.14 | 17.14,17.14 15.24,17.14 14.61,16.51 13.02,16.51 12.8,16.3 C23.1 R29.2 | 17.14,17.14 IC5.2
GND  (via drill 0.6)
  Top 0.254: v17.14,66.36 16.86,66.07 UC1.35 | UC1.20 11.23,68.15 11.75,67.63 11.75,66.67 11.72,66.65 UC1.23 | UC1.47 18.88,71.12 20,71.12 | v13.49,76.04 13.86,75.68 UC1.8
  other vias: 20.64,46.67 16.19,11.43 12.7,18.41 20,29.84 18.41,79.69 17.78,74.93 14.29,37.78 24.13,18.41 32.38,60.33 9.84,60.33 20.95,57.15 16.51,98.11 17.14,87.63 8.89,88.9 15.88,47.62 12.7,66.67 12.06,56.52 24.77,27.94 16.51,26.67 24.77,33.34 24.77,36.83 25.4,46.67 22.23,52.7 23.18,46.67 25.4,49.53 10.79,95.25 12.38,95.25 13.97,95.25 15.56,95.25 27.94,56.2 27.62,74.93 36.83,101.6 34.92,104.14 10.48,88.9 12.06,88.9 8.89,90.49 10.48,90.49 23.5,60.64 17.14,18.73 11.43,30.48 8.89,87.31 8.89,85.72 20.32,70.33
  pour Top: 0,106.68 0,0 10.79,0 10.79,2.54 13.34,5.08 13.34,7.62 10.79,10.16 10.79,20 12.7,21.91 12.7,47.31 14.61,49.21 14.61,55.88 15.24,55.88 15.24,48.9 13.34,46.99 13.34,21.59 11.43,19.68 11.43,10.48 13.97,7.94 13.97,4.76 11.43,2.22 11.43,0 38.73,0 38.73,106.68
  pour Bottom: 0,106.68 0,0 10.79,0 10.79,2.54 13.34,5.08 13.34,7.62 10.79,10.16 10.79,20 12.7,21.91 12.7,47.31 14.61,49.21 14.61,55.88 15.24,55.88 15.24,48.9 13.34,46.99 13.34,21.59 11.43,19.68 11.43,10.48 13.97,7.94 13.97,4.76 11.43,2.22 11.43,0 38.73,0 38.73,106.68
JTCK  (via drill 0.6)
  Top 0.254: v20.32,65.72 19.89,66.15 UC1.37
  Bottom 0.254: JP2.4 34.92,90.81 33.34,89.22 33.34,86.36 31.11,84.14 28.89,84.14 26.04,81.28 26.04,78.74 25.08,77.79 25.08,69.22 24.13,68.26 22.23,68.26 20.32,66.36 v20.32,65.72
JTDI  (via drill 0.6)
  Top 0.254: UC1.38 18.88,66.67 20.32,66.67 21.75,68.1 23.34,68.1 25.4,70.17 25.4,73.98 27.94,76.52 27.94,79.69 v27.62,80.01
  Bottom 0.254: JP2.8 34.92,88.27 34.61,87.95 34.61,85.72 31.75,82.87 29.53,82.87 27.62,80.96 v27.62,80.01
JTDO  (via drill 0.6)
  Top 0.254: UC1.39 19.84,67.15 21.43,68.74 23.02,68.74 24.77,70.48 24.77,74.3 27.3,76.83 27.3,78.42 v26.99,78.74
  Bottom 0.254: JP2.6 34.92,89.53 33.97,88.58 33.97,86.04 31.43,83.5 29.21,83.5 26.67,80.96 26.67,79.06 v26.99,78.74
JTMS  (via drill 0.6)
  Top 0.254: v20.32,63.82 20.32,61.59 20,61.28 16.83,61.28 16.36,61.75 UC1.34
  Bottom 0.254: JP2.2 34.92,92.08 32.7,89.85 32.7,86.68 30.8,84.77 28.57,84.77 25.4,81.6 25.4,79.06 24.45,78.11 24.45,69.53 23.81,68.9 21.91,68.9 19.37,66.36 19.37,64.77 v20.32,63.82
N$1
  Top 0.254: J1.P3 R15.1
N$2  (via drill 0.6)
  Top 0.254: R23.2 12.06,25.4 10.16,27.3 10.16,32.38 10.79,33.02 10.79,40.32 11.75,41.27 11.75,45.72 v12.06,46.04 | v5.08,46.04 5.08,59.69 4.76,60.01 4.76,63.82 5.71,64.77 5.71,66.36 6.67,67.31 6.67,68.58 7.24,69.15 UC1.18
  Bottom 0.254: v12.06,46.04 v5.08,46.04
N$3
  Top 0.254: LED2.A 1.59,77.15 R4.1
N$4
  Top 0.254: LED3.A 1.8,71.97 R6.1
N$5
  Top 0.254: LED4.A 1.59,66.36 R7.1
N$6
  Top 0.254: LED5.A 1.59,60.96 R8.1
N$7
  Top 0.254: UC1.5 15.36,74.09 17.46,76.2 18.73,76.2 19.37,76.83 19.37,77.37 C7.2 19.37,77.57 19.37,78.74 20,79.38 22.54,79.38 23.24,80.07 Q1.2
N$8
  Top 0.254: Q1.1 13.65,80.9 13.65,80.01 14.61,79.06 15.56,79.06 15.98,78.64 C6.2 15.98,75.67 14.86,74.55 UC1.6
N$9
  Top 0.254: R10.2 11.75,54.61 7.94,58.42 7.94,59.37 6.67,60.64 6.67,66.04 7.14,66.52 7.14,67.79 8.01,68.65 UC1.19
N$10
  Top 0.254: UC1.14 6,71.15 4.45,72.71 4.45,73.98 3.07,75.35 R4.2
N$11
  Top 0.254: UC1.15 3.54,70.65 3.17,70.27 R6.2
N$12
  Top 0.254: UC1.16 5.38,70.15 4.13,68.9 4.13,65.72 2.96,64.56 R7.2
N$13
  Top 0.254: UC1.17 5.83,69.65 4.76,68.58 4.76,64.77 4.13,64.14 4.13,60.33 2.96,59.16 R8.2
N$14
  Top 0.254: R15.2 3.66,43.71 Q2.B
N$15
  Top 0.254: C19.2 15.88,22.54 16.19,22.23 16.83,22.23 17.14,21.91 IC5.7 IC5.6 18.41,18.73 19.37,17.78 21.27,17.78 22.86,16.19 22.86,15.66 R26.2
N$16
  Top 0.254: SW6.L1 12.06,21.35 R23.1
N$17
  Top 0.254: SW4.L1 11.75,50.24 R10.1
N$18
  Top 0.254: LED1.A 2.33,92.29 R2.1
N$19  (via drill 0.6)
  Top 0.254: v6.99,72.07 6.99,73.66 5.71,74.93 5.71,76.83 4.45,78.11 4.45,88.58 2.44,90.59 R2.2 | v8.1,67.31 8.43,67.65 UC1.21
  Bottom 0.254: v6.99,72.07 6.99,68.42 v8.1,67.31
N$20
  Top 0.254: IC5.5 19.68,21.91 19.27,22.33 R24.1 19.37,23.28 C20.1
N$21
  Top 0.254: C19.1 15.98,25.08 R22.1 R24.2
N$22  (via drill 0.6)
  Top 0.254: v11.75,17.14 11.75,11.43 15.24,7.94 15.24,3.81 17.14,1.91 J3.P3 | v14.61,21.91 14.61,26.04 15.24,26.67 R20.1
  Bottom 0.254: v14.61,21.91 11.75,19.05 v11.75,17.14
N$24
  Top 0.254: R31.1 12.8,11.33 15.88,8.26 15.88,4.45 17.14,3.17 21.59,3.17 22.86,1.91 J4.P3
N$42
  Top 0.254: C14.2 15.88,42.55 16.19,42.23 16.83,42.23 17.14,41.91 IC4.7 IC4.6 18.41,39.37 18.84,38.95 R17.2
N$43
  Top 0.254: IC4.5 19.68,41.91 19.27,42.33 R14.1 20.85,43.18 C15.1
N$45
  Top 0.254: C14.1 15.98,45.09 R12.1 R14.2
N$56
  Top 0.406: JP3.2 JP3.1 D1.A
N$57
  Top 0.254: J2.P3 1.91,7.62 1.59,7.94 R27.1
N$64
  Top 0.406: JP3.10 JP3.9 D2.C
N$66
  Top 0.254: R27.2 3.35,15.14 Q3.B
POT_1
  Top 0.254: R1.P$2 26.67,85.41 25.72,84.45 9.21,84.45 8.57,83.82 8.57,75.88 10.36,74.1 UC1.13
POT_2
  Top 0.254: R5.P$2 26.67,66.04 28.57,67.94 28.57,72.39 29.84,73.66 29.84,80.96 26.99,83.82 9.53,83.82 9.21,83.5 9.21,76.2 11.86,73.55 UC1.12
POT_3
  Top 0.254: UC1.11 12.36,74 9.84,76.52 9.84,82.87 10.16,83.19 26.67,83.19 29.21,80.64 29.21,73.98 27.94,72.71 27.94,68.26 26.04,66.36 23.18,66.36 22.54,65.72 22.54,63.5 23.5,62.55 28.57,62.55 30.16,60.96 30.16,54.93 28.57,53.34 28.57,49.53 27.94,48.9 27.94,46.99 26.67,45.72 R11.P$2
POT_4
  Top 0.254: R21.P$2 26.67,37.47 22.54,41.59 22.54,44.13 24.13,45.72 24.13,49.85 29.53,55.24 29.53,60.64 28.26,61.91 23.18,61.91 21.91,63.18 21.91,66.04 22.86,66.99 25.72,66.99 27.3,68.58 27.3,73.03 28.57,74.3 28.57,80.33 26.35,82.55 10.79,82.55 10.48,82.23 10.48,76.68 12.86,74.3 UC1.10
RESET  (via drill 0.6)
  Top 0.254: 36.51,56.2 36.61,56.29 SW3.B' SW3.B 36.51,63.82 36.51,67.31 37.78,68.58 37.78,83.82 35.56,86.04 JP2.10 34.61,87 33.97,87.63 33.97,91.76 34.61,92.39 v34.61,93.98 | v14.92,75.88 14.36,75.31 UC1.7 | R3.1 15.24,86.14 v15.24,87.63 17.46,89.85 24.77,89.85 v26.04,91.12
  Bottom 0.254: v34.61,93.98 32.7,95.89 29.53,95.89 26.35,92.71 26.35,91.44 v26.04,91.12 | v14.92,75.88 15.24,76.2 v15.24,87.63
RX  (via drill 0.6)
  Top 0.254: v20.95,60.96 20.8,60.8 14.92,60.8 14.29,61.44 14.29,62.39 14.86,62.96 UC1.31
  Bottom 0.254: v20.95,60.96 21.91,61.91 21.91,66.04 22.86,66.99 25.08,66.99 26.99,68.9 26.99,72.71 29.53,75.25 JP1.4
SW_DUAL  (via drill 0.6)
  Top 0.254: SW2.4 SW2.3 7.94,80.61 7.94,75.56 9.21,74.3 v9.21,73.98 | v12.38,71.12 15.24,71.12 16.36,72.23 UC1.3
  Bottom 0.254: v9.21,73.98 12.06,71.12 v12.38,71.12
SW_MODE  (via drill 0.6)
  Top 0.254: SW1.4 SW1.3 4.45,92.28 4.45,89.53 5.08,88.9 5.08,81.28 7.3,79.06 7.3,75.25 8.26,74.3 8.26,73.03 v8.89,72.39 | v13.34,69.53 14.29,70.48 15.56,70.48 16.86,71.78 UC1.2
  Bottom 0.254: v8.89,72.39 11.75,69.53 v13.34,69.53
SW_TRIG_1  (via drill 0.6)
  Top 0.254: SW6.P5 SW6.P2 6.35,24.77 4.45,26.67 4.45,38.42 6.03,40.01 9.53,40.01 11.11,41.59 11.11,46.35 13.97,49.21 13.97,53.02 v14.61,53.66 | v15.88,67.31 16.21,67.65 UC1.40
  Bottom 0.254: v14.61,53.66 14.92,53.98 14.92,56.52 16.19,57.78 16.19,65.72 15.56,66.36 15.56,66.99 v15.88,67.31
SW_TRIG_2  (via drill 0.6)
  Top 0.254: v6.99,58.74 6.35,58.1 SW4.P2 SW4.P5 | UC1.29 13.86,63.54 13.34,63.02 13.34,62.39 12.7,61.75 12.7,60.64 v13.02,60.33 | v13.02,60.33
  Bottom 0.254: v6.99,58.74 11.43,58.74 v13.02,60.33
TRIG_1  (via drill 0.6)
  Top 0.254: v13.34,54.93 13.34,49.53 10.48,46.67 10.48,41.91 9.21,40.64 5.71,40.64 3.81,38.73 3.81,26.35 5.08,25.08 5.08,17.46 6.03,16.51 8.26,16.51 9.11,15.66 R28.1 9.11,13.55 8.89,13.34 6.03,13.34 5.71,13.65 5.71,14.12 | v15.24,62.07 15.24,62.39 15.86,63 UC1.33
  Top 0.305: Q3.C 5.71,14.12
  Bottom 0.254: v13.34,54.93 13.34,57.15 15.56,59.37 15.56,61.75 v15.24,62.07
TRIG_2  (via drill 0.6)
  Top 0.254: Q2.C R16.1 7.72,43.71 7.62,43.81 v7.62,44.45 v7.62,57.47 | v9.84,57.78 8.57,59.05 8.57,59.69 7.14,61.12 7.14,65.72 7.78,66.36 8.57,66.36 9.36,67.15 UC1.22
  Bottom 0.254: v7.62,57.47 8.26,58.1 9.53,58.1 v9.84,57.78
TX  (via drill 0.6)
  Top 0.254: v20.95,59.37 20,60.33 14.61,60.33 13.81,61.12 13.81,62.71 14.36,63.25 UC1.30
  Bottom 0.254: JP1.5 34.92,72.71 33.02,74.61 29.84,74.61 27.62,72.39 27.62,68.58 25.4,66.36 23.18,66.36 22.54,65.72 22.54,60.96 v20.95,59.37
VCC  (via drill 0.6)
  Top 0.406: IC5.8 15.09,20.7 C21.1 14.29,20.64 13.49,21.43 13.49,33.81 14.92,35.24 14.92,36.83 15.88,37.78 IC4.8 15.72,40.85 C16.1 v14.29,44.13 | 9.99,97.47 9.84,97.33 C2.+ 10.02,97.01 9.53,96.52 9.53,93.34 9.84,93.03 9.93,93.03 10.02,92.95 IC1.3 | 9.99,97.47 10.79,97.47 12.7,99.38 23.18,99.38 29.84,92.71 29.84,89.22 31.43,87.63 31.43,74.61 33.34,72.71 33.34,67.63 33.97,66.99 33.97,48.26 v30.8,45.09 | 9.99,97.47 10.16,97.64 10.16,101.6 9.21,102.55 5.08,102.55 4.45,103.18 D1.C
  Bottom 0.406: v14.29,44.13 15.24,45.09 v30.8,45.09
VEE  (via drill 0.6)
  Top 0.305: 18.1,12.91 18.1,11.75 19.05,10.79 22.23,10.79 24.77,13.34 31.11,13.34 33.66,15.88 33.66,18.41
  Top 0.406: C24.2 19.05,13.02 19.68,13.65 IC5.4 | IC4.4 19.68,34.29 20.32,33.66 | 31.43,34.61 31.43,44.13 34.92,47.62 34.92,67.31 34.29,67.94 34.29,73.03 32.38,74.93 32.38,92.08 33.34,93.03 33.34,94.61 34.92,96.2 C1.- 33.48,97.64 31.11,100.01 D2.A | 20.32,33.66 C18.2 | v21.27,34.61 20.32,33.66 | 31.43,34.61 v30.8,34.61 | 18.1,12.7 18,12.8 C24.2 | 31.43,34.61 31.43,33.02 33.66,30.8 33.66,18.41 31.43,18.41 31.11,18.1 R25.1 | 18.1,12.91 C24.2
  Bottom 0.406: v30.8,34.61 v21.27,34.61

### Text on the board
tPlace: Peaks
bPlace: stripe | Red | Peaks
tNames: RESET | cc-by-sa | Émilie Gillet | 2015. v3 | SYSBOOT
bNames: +12V | GND | GND | GND | -12V | JTMS | mini JTAG | JTCK | JTDO | JTDI | RST | GND | FTDI dongle | <TX | cc-by-sa Émilie Gillet, 2015. v3